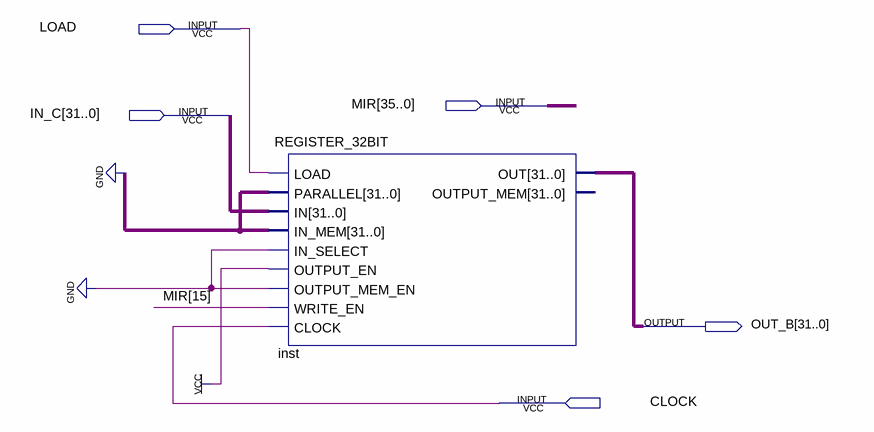
[diagram p0: schematic sheet]
// Quartus schematic H.bdf as structural Verilog: 1 symbols, 5 pins
module H (
  input  LOAD,
  input  [35:0] MIR,
  input  [31:0] IN_C,
  input  CLOCK,
  output [31:0] OUT_B
);

  REGISTER_32BIT inst (
    .LOAD(LOAD), .PARALLEL({32{1'b0}}), .IN(IN_C), .IN_MEM({32{1'b0}}), .IN_SELECT(1'b0), .OUTPUT_EN(1'b1),
    .OUTPUT_MEM_EN(1'b0), .WRITE_EN(MIR[15]), .CLOCK(CLOCK), .OUT(OUT_B));  // open: OUTPUT_MEM
endmodule
